# Altium project CTRL_Freaks_MCU_V2.PrjPcb
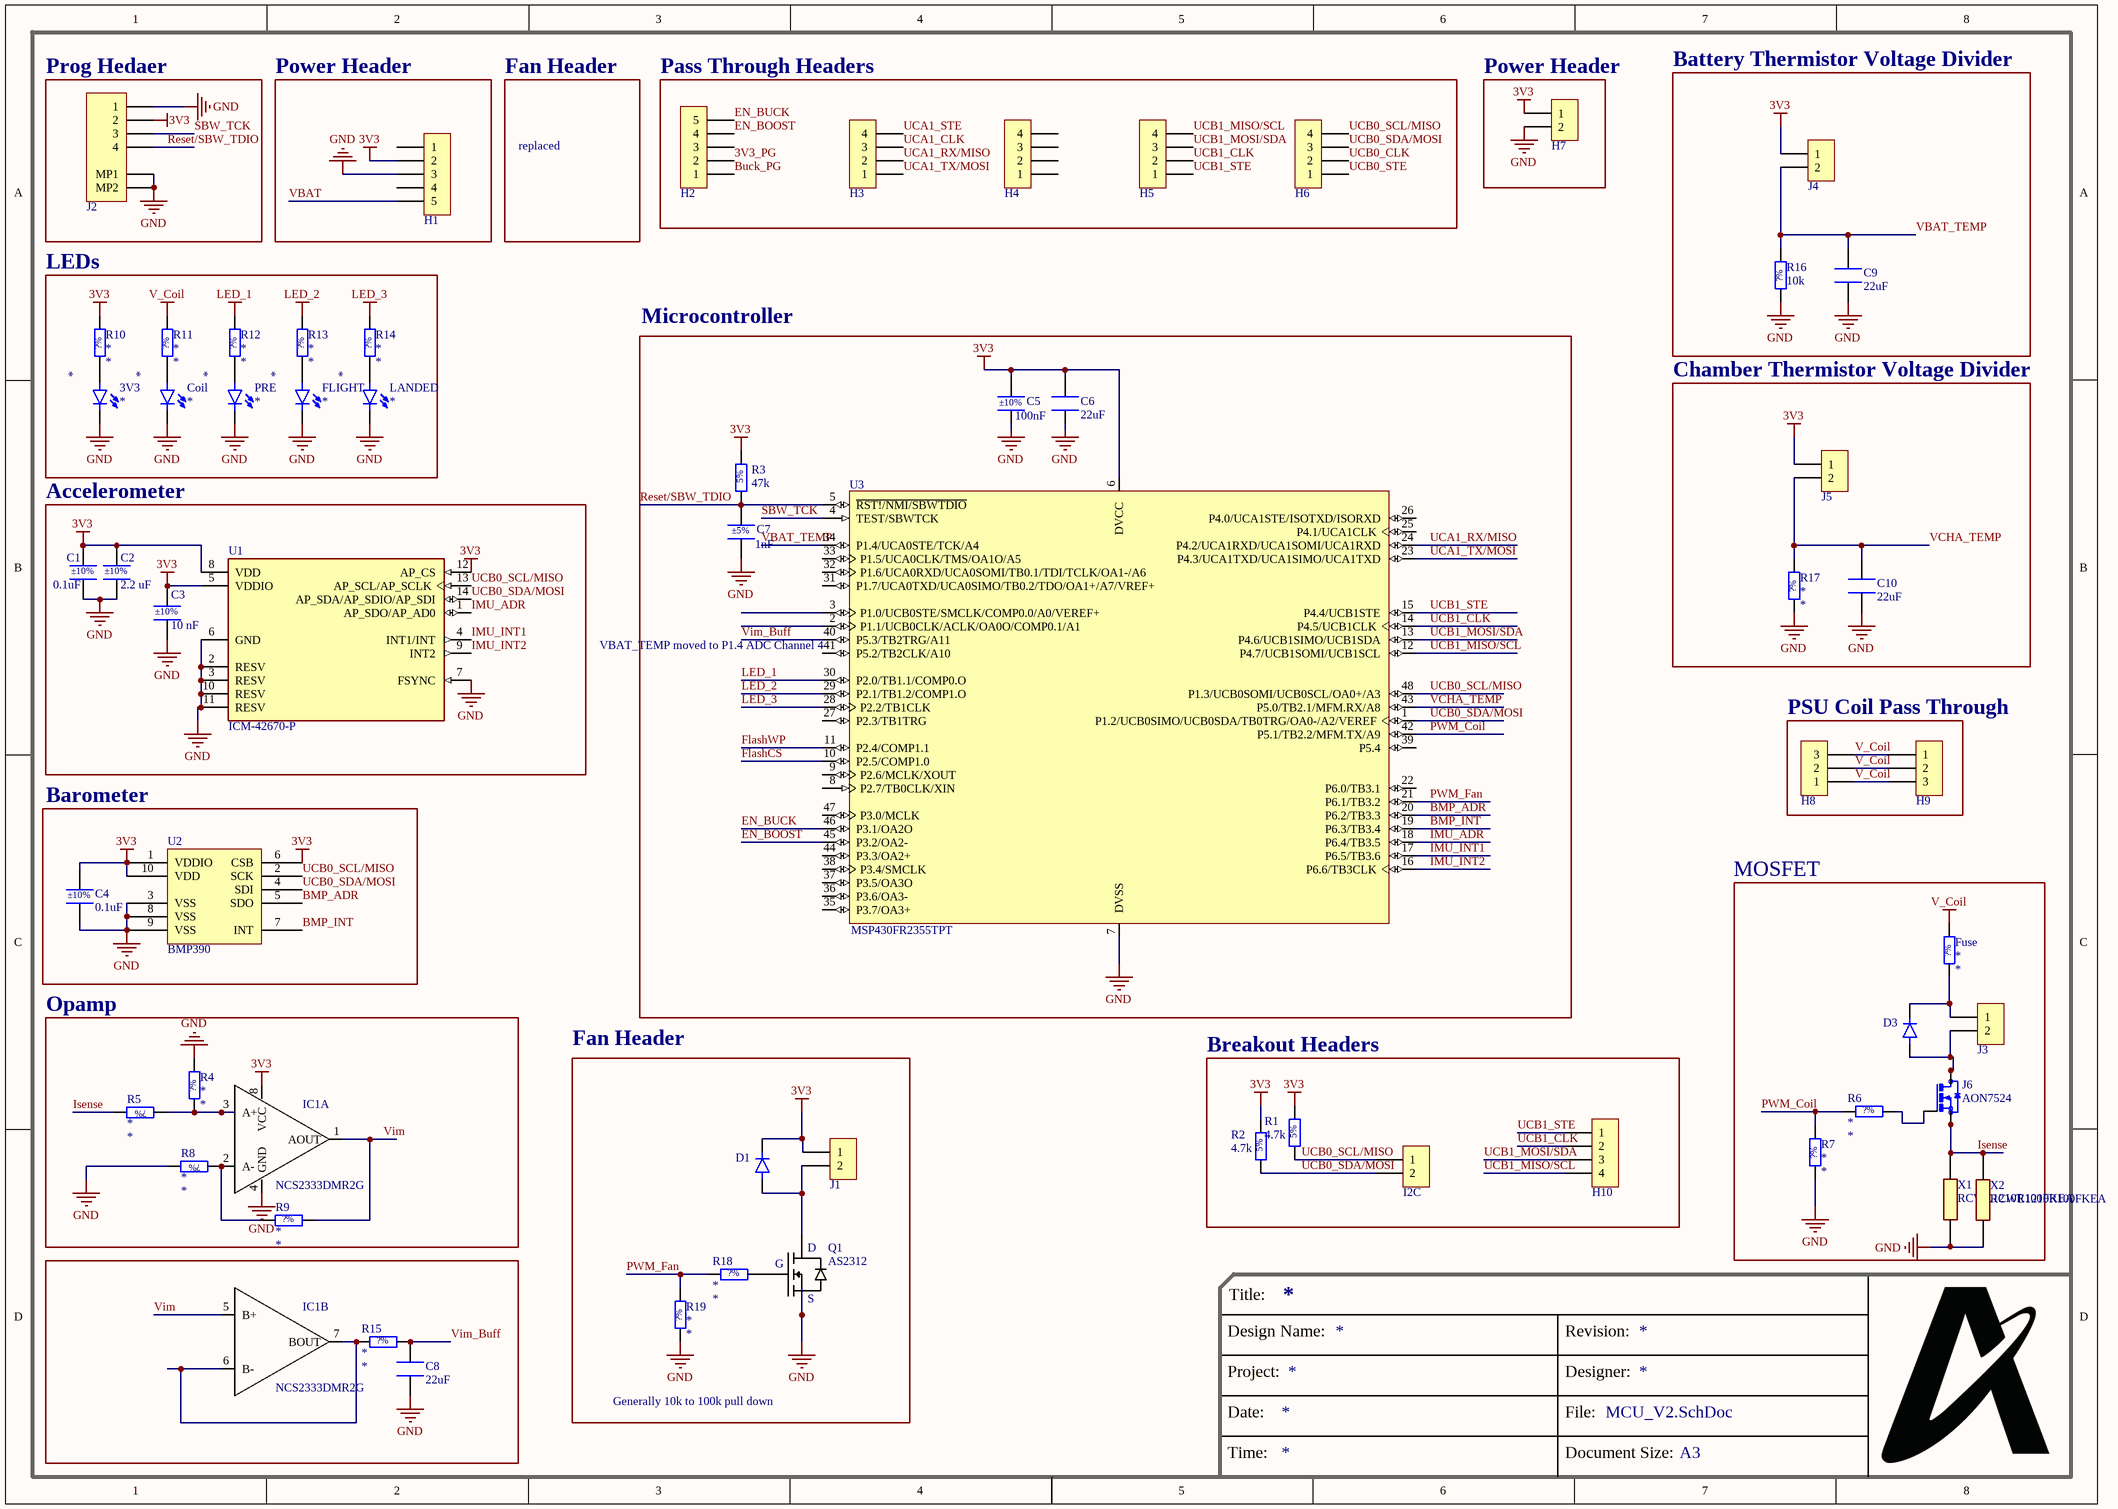
[diagram p0: MCU_V2.SchDoc]
1 sheet, 61 parts. Net scope: global (net labels, ports and power ports of the same name join across sheets).
Board file: MCU_V2.PcbDoc

## Sheet MCU_V2.SchDoc
size A3; PageSetup: Record=PageOptions|CenterHorizontal=True|CenterVertical=True|PrintScale=0.97|XCorrection=1.00|YCorrection=1.00|PrintKind=0|BorderSize=5000000|LeftOffset=0|BottomOffset=0|Orientation=2|PaperLength=1000|PaperWidth=1000|Scale=100|PaperSource=7|PrintQuality=-4|MediaType=1|DitherType=10|PaperKind=A4|PrintScaleMode=1; SheetNumber: 1; SheetTotal: 1

### Parts
3V3  LTST-C190 Series  [LED_0603_1608M_0.80mm]  (value not drawn)
C1  0.1uF  [CAPACITOR_0805_2012M-70N]
C2  2.2 uF  [CAPACITOR_0805_2012M-70N]
C3  10 nF  [CAPACITOR_0805_2012M-70N]
C4  0.1uF  [CAPACITOR_0805_2012M-70N]
C5  100nF  [CAPACITOR_0805_2012M-70N]
C6  22uF  [CAPACITOR_0805_2012M-70N]
C7  1nF  [CAPACITOR_0805_2012M-70N]
C8  22uF  [CAPACITOR_0805_2012M-70N]
C9  22uF  [CAPACITOR_0805_2012M-70N]
C10  22uF  [CAPACITOR_0805_2012M-70N]
Coil  LTST-C190 Series  [LED_0603_1608M_0.80mm]  (value not drawn)
D1  1N4148W-TP  [SOD123-1.35mm-N]  (value not drawn)
D3  1N4148W-TP  [SOD123-1.35mm-N]  (value not drawn)
FLIGHT  LTST-C190 Series  [LED_0603_1608M_0.80mm]  (value not drawn)
Fuse  SF-1206HH10M-2  [RESISTOR_1206_3216M_55N]  (value not drawn)
H1  HDR,2.54mm,1x5  [HEADER_2.54MM_1x5PIN]  (value not drawn)  (no BOM)
H2  HDR,2.54mm,1x5  [HEADER_2.54MM_1x5PIN]  (value not drawn)  (no BOM)
H3  HDR,2.54mm,1x4  [HEADER_2.54MM_1x4PIN]  (value not drawn)  (no BOM)
H4  HDR,2.54mm,1x4  [HEADER_2.54MM_1x4PIN]  (value not drawn)  (no BOM)
H5  HDR,2.54mm,1x4  [HEADER_2.54MM_1x4PIN]  (value not drawn)  (no BOM)
H6  HDR,2.54mm,1x4  [HEADER_2.54MM_1x4PIN]  (value not drawn)  (no BOM)
H7  HDR,2.54mm,1x2  [HEADER_2.54MM_1x2PIN]  (value not drawn)  (no BOM)
H8  HDR,2.54mm,1x3  [HEADER_2.54MM_1x3PIN]  (value not drawn)  (no BOM)
H9  HDR,2.54mm,1x3  [HEADER_2.54MM_1x3PIN]  (value not drawn)  (no BOM)
H10  HDR,2.54mm,1x4  [HEADER_2.54MM_1x4PIN]  (value not drawn)  (no BOM)
I2C  HDR,2.54mm,1x2  [HEADER_2.54MM_1x2PIN]  (value not drawn)  (no BOM)
IC1  NCS2333DMR2G  [*MSOP8]  (parts A,B of 2)
J1  0530470210  [MOLEX_0530470210]  (value not drawn)
J2  5015680407  [MOLEX_5015680407]  (value not drawn)
J3  0530470210  [MOLEX_0530470210]  (value not drawn)
J4  0530470210  [MOLEX_0530470210]  (value not drawn)
J5  0530470210  [MOLEX_0530470210]  (value not drawn)
J6  AON7524  [DFN3X3A-8LEP1]
LANDED  LTST-C190 Series  [LED_0603_1608M_0.80mm]  (value not drawn)
PRE  LTST-C190 Series  [LED_0603_1608M_0.80mm]  (value not drawn)
Q1  AS2312  [SOT23-3N-1.15mm]
R1  4.7k  [Resistor_0805_2012M-50N]
R2  4.7k  [Resistor_0805_2012M-50N]
R3  47k  [Resistor_0805_2012M-50N]
R4  *  [RESISTOR_0805_2012M-50N]
R5  *  [RESISTOR_0805_2012M-50N]
R6  *  [RESISTOR_0805_2012M-50N]
R7  *  [RESISTOR_0805_2012M-50N]
R8  *  [RESISTOR_0805_2012M-50N]
R9  *  [RESISTOR_0805_2012M-50N]
R10  *  [RESISTOR_0805_2012M-50N]
R11  *  [RESISTOR_0805_2012M-50N]
R12  *  [RESISTOR_0805_2012M-50N]
R13  *  [RESISTOR_0805_2012M-50N]
R14  *  [RESISTOR_0805_2012M-50N]
R15  *  [Resistor_0805_2012M-50N]
R16  10k  [RESISTOR_0805_2012M-50N]
R17  *  [RESISTOR_0805_2012M-50N]
R18  *  [RESISTOR_0805_2012M-50N]
R19  *  [RESISTOR_0805_2012M-50N]
U1  ICM-42670-P  [XDCR_ICM-42670-P-EXTENDED_PADS]
U2  BMP390  [BMP390]
U3  MSP430FR2355TPT  [LQFP_PT_48_N]
X1  RCWE1210R100FKEA  [RESC3125X70N]
X2  RCWE1210R100FKEA  [RESC3125X70N]

### Blocks framed on the sheet
Prog Hedaer: J2
Power Header: H1
Pass Through Headers: H2-H6
Power Header: H7
Battery Thermistor Voltage Divider: C9 J4 R16
LEDs: 3V3 Coil FLIGHT LANDED PRE R10-R14
Microcontroller: C5-C7 R3 U3
Chamber Thermistor Voltage Divider: C10 J5 R17
Accelerometer: C1-C3 U1
PSU Coil Pass Through: H8 H9
Barometer: C4 U2
MOSFET: D3 Fuse J3 J6 R6 R7 X1 X2
Opamp: IC1 R4 R5 R8 R9
Fan Header: D1 J1 Q1 R18 R19
Breakout Headers: H10 I2C R1 R2

### Nets
3V3: C1.2 C2.2 C3.2 C4.2 C5.2 C6.2 D1.C H1.2 H7.1 IC1.8(VCC) J1.1 J2.2 J4.1 J5.1 R1.2 R2.2 R3.2 R10.2 U1.5(VDDIO) U1.8(VDD) U1.12(AP_CS) U2.1(VDDIO) U2.6(CSB) U2.10(VDD) U3.6(DVCC)
GND: 3V3.C C1.1 C2.1 C3.1 C4.1 C5.1 C6.1 C7.1 C8.1 C9.1 C10.1 Coil.C FLIGHT.C H1.3 H7.2 IC1.4(GND) J2.1 J2.MP1 J2.MP2 LANDED.C PRE.C Q1.2(S) R4.2 R7.1 R8.2 R16.1 R17.1 R19.1 U1.2(RESV) U1.3(RESV) U1.6(GND) U1.7(FSYNC) U1.10(RESV) U1.11(RESV) U2.3(VSS) U2.8(VSS) U2.9(VSS) U3.7(DVSS) X1.1 X2.1
LED_1: R12.2 U3.30(P2.0/TB1.1/COMP0.O)
LED_2: R13.2 U3.29(P2.1/TB1.2/COMP1.O)
LED_3: R14.2 U3.28(P2.2/TB1CLK)
V_Coil: Fuse.2 H8.1 H8.2 H8.3 H9.1 H9.2 H9.3 R11.2
3V3_PG: H2.2
BMP_ADR: U2.5(SDO) U3.20(P6.2/TB3.3)
BMP_INT: U2.7(INT) U3.19(P6.3/TB3.4)
Buck_PG: H2.1
EN_BOOST: H2.4 U3.45(P3.2/OA2-)
EN_BUCK: H2.5 U3.46(P3.1/OA2O)
FlashCS: U3.10(P2.5/COMP1.0)
FlashWP: U3.11(P2.4/COMP1.1)
IMU_ADR: U1.1(AP_SDO/AP_AD0) U3.18(P6.4/TB3.5)
IMU_INT1: U1.4(INT1/INT) U3.17(P6.5/TB3.6)
IMU_INT2: U1.9(INT2) U3.16(P6.6/TB3CLK)
Isense: J6.P$1(S) J6.P$2(S) J6.P$3(S) R5.2 X1.2 X2.2
PWM_Coil: R6.1 R7.2 U3.42(P5.1/TB2.2/MFM.TX/A9)
PWM_Fan: R18.1 R19.2 U3.21(P6.1/TB3.2)
Reset/SBW_TDIO: C7.2 J2.4 R3.1 U3.5(~{RST!/NMI/SBWTDIO})
SBW_TCK: J2.3 U3.4(TEST/SBWTCK)
UCA1_CLK: H3.3
UCA1_RX/MISO: H3.2 U3.24(P4.2/UCA1RXD/UCA1SOMI/UCA1RXD)
UCA1_STE: H3.4
UCA1_TX/MOSI: H3.1 U3.23(P4.3/UCA1TXD/UCA1SIMO/UCA1TXD)
UCB0_CLK: H6.2
UCB0_SCL/MISO: H6.4 I2C.1 R1.1 U1.13(AP_SCL/AP_SCLK) U2.2(SCK) U3.48(P1.3/UCB0SOMI/UCB0SCL/OA0+/A3)
UCB0_SDA/MOSI: H6.3 I2C.2 R2.1 U1.14(AP_SDA/AP_SDIO/AP_SDI) U2.4(SDI) U3.1(P1.2/UCB0SIMO/UCB0SDA/TB0TRG/OA0-/A2/VEREF)
UCB0_STE: H6.1
UCB1_CLK: H5.2 H10.2 U3.14(P4.5/UCB1CLK)
UCB1_MISO/SCL: H5.4 H10.4 U3.12(P4.7/UCB1SOMI/UCB1SCL)
UCB1_MOSI/SDA: H5.3 H10.3 U3.13(P4.6/UCB1SIMO/UCB1SDA)
UCB1_STE: H5.1 H10.1 U3.15(P4.4/UCB1STE)
VBAT: H1.5
VBAT_TEMP: C9.2 J4.2 R16.2 U3.34(P1.4/UCA0STE/TCK/A4)
VCHA_TEMP: C10.2 J5.2 R17.2 U3.43(P5.0/TB2.1/MFM.RX/A8)
Vim: IC1.1(AOUT) IC1.5(B+) R9.2
Vim_Buff: C8.2 R15.2 U3.40(P5.3/TB2TRG/A11)
Net3V3_A: 3V3.A R10.1
NetCoil_A: Coil.A R11.1
NetD1_A: D1.A J1.2 Q1.3(D)
NetD3_A: D3.A J3.2 J6.P$5(D) J6.P$6(D) J6.P$7(D) J6.P$8(D) J6.P$9(D) J6.P$10(D) J6.P$11(D)
NetD3_C: D3.C Fuse.1 J3.1
NetFLIGHT_A: FLIGHT.A R13.1
NetIC1_2: IC1.2(A-) R8.1 R9.1
NetIC1_3: IC1.3(A+) R4.1 R5.1
NetIC1_6: IC1.6(B-) IC1.7(BOUT) R15.1
NetJ6_P$4: J6.P$4(G) R6.2
NetLANDED_A: LANDED.A R14.1
NetPRE_A: PRE.A R12.1
NetQ1_1: Q1.1(G) R18.2

Not connected (* = marked no-connect by the designer): H1 1 4; H2 3; H4 1 2 3 4; U3 2(P1.1/UCB0CLK/ACLK/OA0O/COMP0.1/A1) 3(P1.0/UCB0STE/SMCLK/COMP0.0/A0/VEREF+) 8(P2.7/TB0CLK/XIN) 9(P2.6/MCLK/XOUT) 22(P6.0/TB3.1) 25(P4.1/UCA1CLK) 26(P4.0/UCA1STE/ISOTXD/ISORXD) 27(P2.3/TB1TRG) 31(P1.7/UCA0TXD/UCA0SIMO/TB0.2/TDO/OA1+/A7/VREF+) 32(P1.6/UCA0RXD/UCA0SOMI/TB0.1/TDI/TCLK/OA1-/A6) 33(P1.5/UCA0CLK/TMS/OA1O/A5) 35(P3.7/OA3+) 36(P3.6/OA3-) 37(P3.5/OA3O) 38(P3.4/SMCLK) 39(P5.4) 41(P5.2/TB2CLK/A10) 44(P3.3/OA2+) 47(P3.0/MCLK)

### Notes on the sheet
- Fan Header
- replaced
- (near U3) VBAT_TEMP moved to P1.4 ADC Channel 4
- Generally 10k to 100k pull down
- Title:
- Design Name:
- Project:
- Revision:
- Designer:
- Date:
- Time:
- File:
- Document Size:
- A3

### Library data of the parts
3V3 Coil FLIGHT LANDED PRE = LTST-C190 Series: Diode - LED, 0603; APSS Standard Part: APSS Standard; Temp Range: -30°C ~ 85°C; Rated Voltage: 5V Reverse; Package: 0603; Supplier 1: Digikey; MF Part No.: *; Colour: *
C1-C5 = Generic Capacitor: MF Part No.: C0805C104K5RAC7800; Tolerance: ±10%; Temperature Coefficient: X7R; Rated Voltage: 50V; Capacitance at Rated Voltage: 40%; Temp Range: -55°C ~ 125°C; Supplier 1: Digikey; Supplier 1 Part No.: 399-C0805C104K5RAC7800CT-ND; Package: 0805
  C1 C4: Value: 0.1uF
  C2: Value: 2.2 uF
  C3: Value: 10 nF
  C5: Value: 100nF
C6 C8-C10 = C0805C226M9PACTU: Passive - Capacitor, X5R, 22uF Max, 6.3V, 0805 (2012 Metric), ±20%, -55°C ~ 85°C. 8.8uF @ 5V; APSS Standard Part: APSS Standard; Capacitance at Rated Voltage: 30%; Tolerance: ±20%; Temperature Coefficient: X5R; Rated Voltage: 6.3V; Temp Range: -55°C ~ 85°C; Supplier 1: Digikey; Supplier 1 Part No.: 399-C0805C226M9PAC7800CT-ND; MF Part No.: C0805C226M9PACTU; Value: 22uF
  C6: Package: 0402
  C8-C10: Package: 0805
C7 = Generic Capacitor: MF Part No.: 399-C0805C102J5GAC7800CT-ND; Tolerance: ±5%; Temperature Coefficient: X7R; Rated Voltage: 50V; Capacitance at Rated Voltage: 100%; Temp Range: -55°C ~ 125°C; Supplier 1: Digikey; Supplier 1 Part No.: 399-C0805C102J5GAC7800CT-ND; Package: 0805; Value: 1nF
D1 D3 = 1N4148W-TP: Diode - Low Reverse Leakage, 1.25 Vf @ 150 mA, 1 µA Reverse @ 75 V, SOD-123; APSS Standard Part: APSS Standard; Temp Range: -65°C ~ 150°C; Rated Voltage: 100V Reverse; MF Part No.: 1N4148W-TP; Package: SOD-123; Supplier 1: Digikey; Supplier 1 Part No.: 1N4148WTPMSCT-ND
Fuse R4-R19 = Generic Resistor: Passive - Resistor, Generic; Tolerance: ?%; MF Part No.: *
  Fuse R4-R15 R17-R19: Value: *
  R16: Value: 10k
H1 H2 = HDR,2.54mm,1x5: Connector - 2.54mm, 1x5-pin
H3-H6 H10 = HDR,2.54mm,1x4: Connector - 2.54mm, 1x4-pin
H7 I2C = HDR,2.54mm,1x2: Connector - 2.54mm, 1x2-pin
H8 H9 = HDR,2.54mm,1x3: Connector - 2.54mm, 1x3-pin
J1 J3-J5 = 0530470210: Connector - Picoblade 02-pin, TH, STR; APSS Standard Part: APSS Standard; Pitch: 1.25mm; Mounting Type: Through-hole; Orientation: Straight; MF Part No.: 0530470210; Pins: 2; Supplier 1: Digikey; Supplier 1 Part No.: WM1731-ND
J2 = 5015680407: Connector - Picoclasp  04-pin, SMT, RA; APSS Standard Part: APSS Standard; Pitch: 1mm; Mounting Type: Surface Mount; Orientation: Straight; MF Part No.: 5015680407; Pins: 4; Supplier 1: Digikey; Supplier 1 Part No.: WM7895CT-ND
J6 = AON7524: N-Channel 30 V 25A (Ta), 28A (Tc) 3.1W (Ta), 32W (Tc) Surface Mount 8-DFN-EP (3x3); MF: Alpha &; SnapEDA_Link: https://www.snapeda.com/parts/AON7524/Alpha/view-part/?ref=snap; Package: DFN-8 Alpha &amp;; Value: *; MP: AON7524; Check_prices: https://www.snapeda.com/parts/AON7524/Alpha/view-part/?ref=eda
Q1 = AS2312: Transistor - MOSFET, N-Channel AS2312; APSS Standard Part: APSS Standard; Temp Range: 0°C ~ 150°C (TJ); Rated Voltage: 20 Vds; Power: 1.2W; MF Part No.: AS2312; Package: SOT-23-3; Supplier 1: Digikey; Supplier 1 Part No.: 4530-AS2312CT-ND
R1 R2 = RMCF0805JT Series: Passive - Resistor Series, 0805, 5%, 100m - 22M, E24, 0.063W, 1/16W, ±200ppm/°C, -55°C ~ 155°C, 0805 (2012 Metric); MF Part No.: RMCF0805JT4K70; APSS Standard Part: APSS Standard; Power: 1/8W; Value Range: 100m ~ 22M; Rated Voltage: 150V; Tolerance: 5%; E Series: E24; Temp Range: -55°C ~ 155°C; Supplier 1: Digikey; Package: 0805; Temperature Coefficient: ±200ppm/°C; Value: 4.7k
R3 = RMCF0805JT Series: Passive - Resistor Series, 0805, 5%, 100m - 22M, E24, 0.063W, 1/16W, ±200ppm/°C, -55°C ~ 155°C, 0805 (2012 Metric); MF Part No.: RMCF0805JT47K0; APSS Standard Part: APSS Standard; Power: 1/8W; Value Range: 100m ~ 22M; Rated Voltage: 150V; Tolerance: 5%; E Series: E24; Temp Range: -55°C ~ 155°C; Supplier 1: Digikey; Package: 0805; Temperature Coefficient: ±200ppm/°C; Value: 47k
U1 = ICM-42670-P: IC - Inertial Management Unit: Accelerometer + Gyro + Temperature Sensor, 6 Axis, I2C / I3C / SPI Interfaces; APSS Standard Part: APSS Standard; Rated Voltage: 3.6V; Temp Range: -40°C ~ 85°C; Package: 14-LGA; MF Part No.: ICM-42670-P; Supplier 1: Digikey; Supplier 1 Part No.: 1428-ICM-42670-PCT-ND
U2 = BMP390: Digital Pressure Sensor; APSS Standard Part: APSS Standard; Temp Range: -40°C ~ 85°C; Pressure Range: 30 kPa ~ 125 kPa; Package: LGA; Pins: 10; Supplier 1: Digikey; Supplier 1 Part No.: 828-BMP390CT-ND; Supplier 2: *; Supplier 2 Part No.: *; MF Part No.: BMP390
U3 = MSP430FR2355TPT: IC - Microcontroller, LQFP-48, 24MHz, 32KB FRAM, Op-Amps/PGAs, 12-bit DACs, 12-bit ADC, -40 to 105C; APSS Standard Part: APSS Standard; Temp Range: -40°C ~ 105°C; Rated Voltage: 3.6V; MF Part No.: MSP430FR2355TPT; Package: LQFP-48; Supplier 1: Digikey; Supplier 1 Part No.: 296-50260-ND
X1 X2 = RCWE1210R100FKEA: Res Thick Film 1210 0.1 Ohm 1% 1W +/-100ppm/C Sulfur Resistant Pad SMD Automotive T/R; Manufacturer_Name: Vishay; Geometry.Height: 0.7mm; Mouser Part Number: 71-RCWE1210R100FKEA; Mouser Price/Stock: https://www.mouser.co.uk/ProductDetail/Vishay-Dale/RCWE1210R100FKEA?qs=ky7aQRddhuh3IQZv%2FTVUyQ%3D%3D; Manufacturer_Part_Number: RCWE1210R100FKEA; Datasheet Link: https://www.arrow.com/en/products/rcwe1210r100fkea/vishay?region=nac
IC1 = NCS2333DMR2G: SnapEDA_Link: https://www.snapeda.com/parts/NCS2333DMR2G/Onsemi/view-part/?ref=snap; Check_prices: https://www.snapeda.com/parts/NCS2333DMR2G/Onsemi/view-part/?ref=eda; Value: *